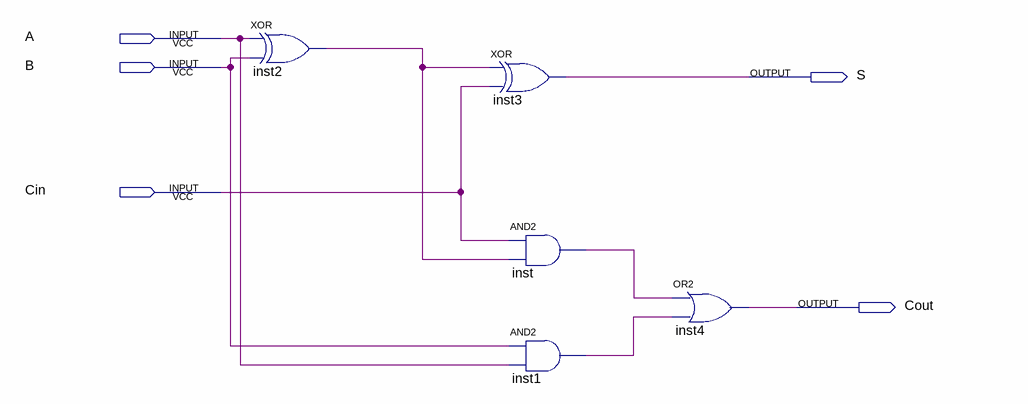
[diagram p0: schematic sheet]
// Quartus schematic FullAdder.bdf as structural Verilog: 5 symbols, 5 pins
module FullAdder (
  input  A,
  input  B,
  input  Cin,
  output S,
  output Cout
);

  wire inst1_out, inst2_out, inst_out;

  xor inst2 (inst2_out, A, B);
  xor inst3 (S, inst2_out, Cin);
  and inst (inst_out, Cin, inst2_out);
  and inst1 (inst1_out, B, A);
  or inst4 (Cout, inst_out, inst1_out);
endmodule
